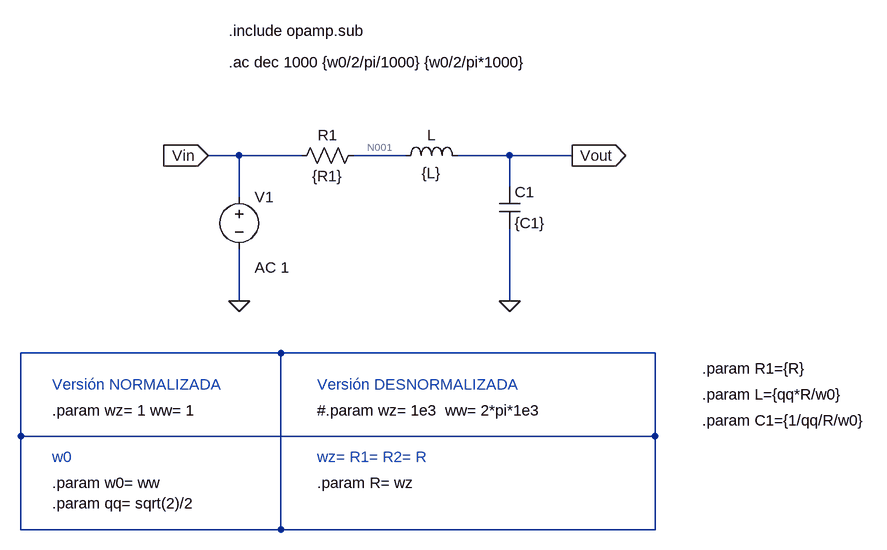
[diagram p0: schematic 01.asc]
01.asc, the LTspice schematic file:
Version 4
SHEET 1 1836 888
WIRE -192 -192 -240 -192
WIRE -96 -192 -192 -192
WIRE 64 -192 -16 -192
WIRE 224 -192 144 -192
WIRE 320 -192 224 -192
WIRE 224 -144 224 -192
WIRE -192 -128 -192 -192
WIRE -192 32 -192 -48
WIRE 224 32 224 -80
WIRE -128 112 -528 112
WIRE 448 112 -128 112
WIRE -528 240 -528 112
WIRE 448 240 448 112
WIRE 448 240 -528 240
WIRE -528 384 -528 240
WIRE -128 384 -128 112
WIRE -128 384 -528 384
WIRE 448 384 448 240
WIRE 448 384 -128 384
FLAG 224 32 0
FLAG -192 32 0
FLAG -240 -192 Vin
IOPIN -240 -192 In
FLAG 320 -192 Vout
IOPIN 320 -192 Out
SYMBOL res 0 -208 R90
WINDOW 0 0 56 VBottom 2
WINDOW 3 32 56 VTop 2
SYMATTR InstName R1
SYMATTR Value {R1}
SYMBOL cap 208 -144 R0
SYMATTR InstName C1
SYMATTR Value {C1}
SYMBOL voltage -192 -144 R0
WINDOW 123 24 124 Left 2
WINDOW 39 0 0 Left 0
SYMATTR Value2 AC 1
SYMATTR InstName V1
SYMATTR Value ""
SYMBOL ind 48 -176 R270
WINDOW 0 32 56 VTop 2
WINDOW 3 5 56 VBottom 2
SYMATTR InstName L
SYMATTR Value {L}
TEXT -208 -384 Left 2 !.include opamp.sub
TEXT -208 -336 Left 2 !.ac dec 1000 {w0/2/pi/1000} {w0/2/pi*1000}
TEXT -480 160 Left 2 ;Versión NORMALIZADA
TEXT -480 200 Left 2 !.param wz= 1 ww= 1
TEXT -72 160 Left 2 ;Versión DESNORMALIZADA
TEXT -72 200 Left 2 !#.param wz= 1e3  ww= 2*pi*1e3
TEXT 520 216 Left 2 !.param C1={1/qq/R/w0}
TEXT -480 272 Left 2 ;w0
TEXT -480 312 Left 2 !.param w0= ww\n.param qq= sqrt(2)/2
TEXT -72 272 Left 2 ;wz= R1= R2= R
TEXT -72 312 Left 2 !.param R= wz
TEXT 520 136 Left 2 !.param R1={R}
TEXT 520 176 Left 2 !.param L={qq*R/w0}

The netlist it stands for:
* 01.asc
R1 N001 Vin {R1}
C1 Vout 0 {C1}
V1 Vin 0 AC 1
L N001 Vout {L}
.include opamp.sub
.ac dec 1000 {w0/2/pi/1000} {w0/2/pi*1000}
* Versión NORMALIZADA
.param wz= 1 ww= 1
* Versión DESNORMALIZADA
#.param wz= 1e3  ww= 2*pi*1e3
.param C1={1/qq/R/w0}
* w0
.param w0= ww
.param qq= sqrt(2)/2
* wz= R1= R2= R
.param R= wz
.param R1={R}
.param L={qq*R/w0}
.backanno
.end

* Results of the author's LTspice run, read from the files saved beside the schematic
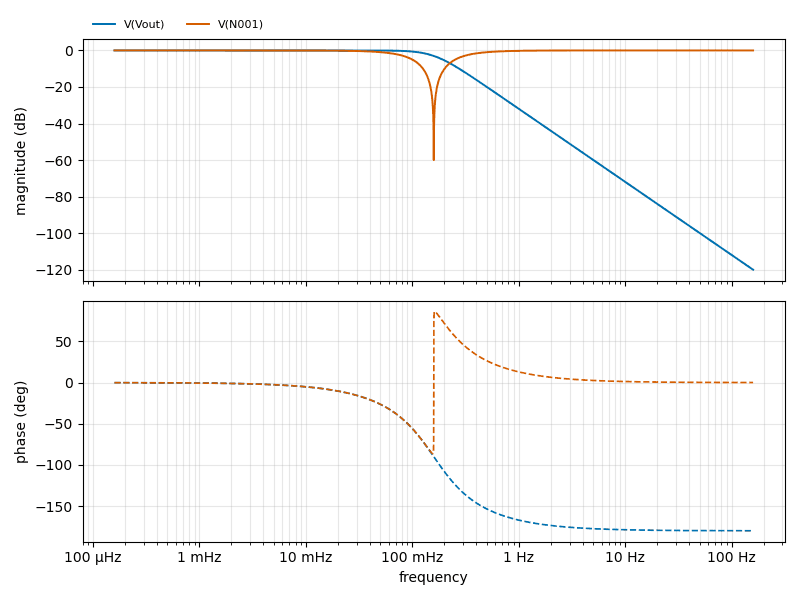
[diagram p1: AC Analysis of 01.asc, plotted from the saved traces]
* AC Analysis, 1 run:
*   V(Vout): -0.00 dB at 159.2 µHz, -120.00 dB at 159.2 Hz, peak -0.00 dB at 159.2 µHz, 3 dB below the peak at 159 mHz
*   V(N001): -0.00 dB at 159.2 µHz, -0.00 dB at 159.2 Hz, peak -0.00 dB at 159.2 µHz, 3 dB below the peak at 82.34 mHz